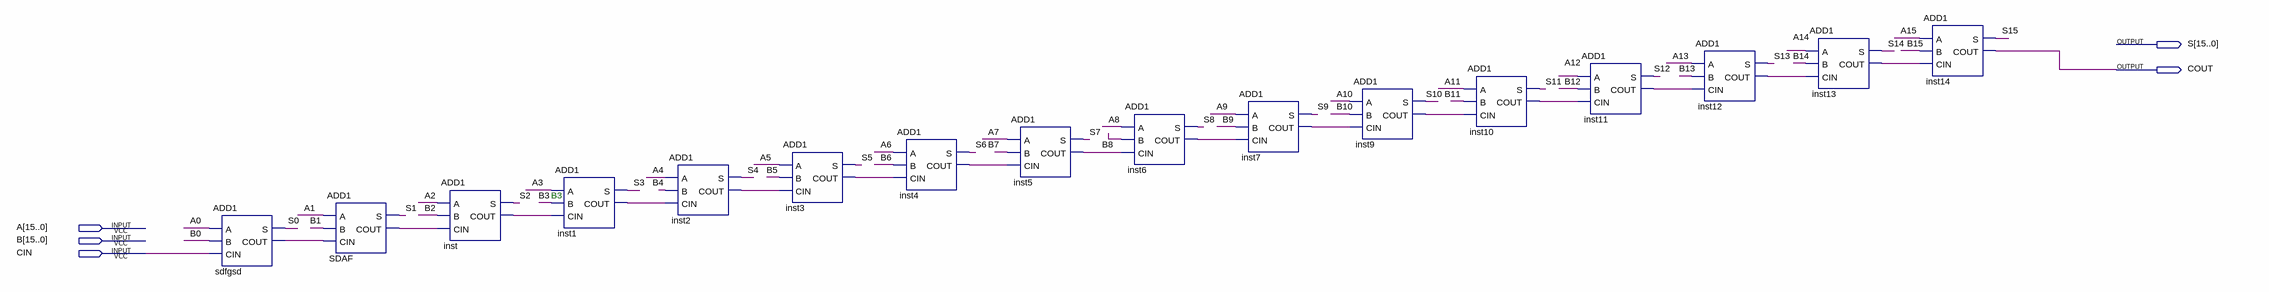
[diagram p0: schematic sheet]
// Quartus schematic ADD16.bdf as structural Verilog: 16 symbols, 5 pins
module ADD16 (
  input  [15:0] A,
  input  [15:0] B,
  input  CIN,
  output [15:0] S,
  output COUT
);

  wire inst1_cout, inst2_cout, inst3_cout, inst4_cout, inst5_cout, inst6_cout, inst7_cout, inst9_cout,
       inst10_cout, inst11_cout, inst12_cout, inst13_cout, inst_cout, SDAF_cout, sdfgsd_cout;

  ADD1 sdfgsd (.A(A[0]), .B(B[0]), .CIN(CIN), .S(S[0]), .COUT(sdfgsd_cout));
  ADD1 SDAF (.A(A[1]), .B(B[1]), .CIN(sdfgsd_cout), .S(S[1]), .COUT(SDAF_cout));
  ADD1 inst (.A(A[2]), .B(B[2]), .CIN(SDAF_cout), .S(S[2]), .COUT(inst_cout));
  ADD1 inst1 (.A(A[3]), .B(B[3]), .CIN(inst_cout), .S(S[3]), .COUT(inst1_cout));
  ADD1 inst2 (.A(A[4]), .B(B[4]), .CIN(inst1_cout), .S(S[4]), .COUT(inst2_cout));
  ADD1 inst3 (.A(A[5]), .B(B[5]), .CIN(inst2_cout), .S(S[5]), .COUT(inst3_cout));
  ADD1 inst4 (.A(A[6]), .B(B[6]), .CIN(inst3_cout), .S(S[6]), .COUT(inst4_cout));
  ADD1 inst5 (.A(A[7]), .B(B[7]), .CIN(inst4_cout), .S(S[7]), .COUT(inst5_cout));
  ADD1 inst6 (.A(A[8]), .B(B[8]), .CIN(inst5_cout), .S(S[8]), .COUT(inst6_cout));
  ADD1 inst7 (.A(A[9]), .B(B[9]), .CIN(inst6_cout), .S(S[9]), .COUT(inst7_cout));
  ADD1 inst9 (.A(A[10]), .B(B[10]), .CIN(inst7_cout), .S(S[10]), .COUT(inst9_cout));
  ADD1 inst10 (.A(A[11]), .B(B[11]), .CIN(inst9_cout), .S(S[11]), .COUT(inst10_cout));
  ADD1 inst11 (.A(A[12]), .B(B[12]), .CIN(inst10_cout), .S(S[12]), .COUT(inst11_cout));
  ADD1 inst12 (.A(A[13]), .B(B[13]), .CIN(inst11_cout), .S(S[13]), .COUT(inst12_cout));
  ADD1 inst13 (.A(A[14]), .B(B[14]), .CIN(inst12_cout), .S(S[14]), .COUT(inst13_cout));
  ADD1 inst14 (.A(A[15]), .B(B[15]), .CIN(inst13_cout), .S(S[15]), .COUT(COUT));

  // Notes on the sheet:
  //   B3
endmodule
